# EAGLE design echo (EAGLE 7.4.0)

## Sheet 1 of 2
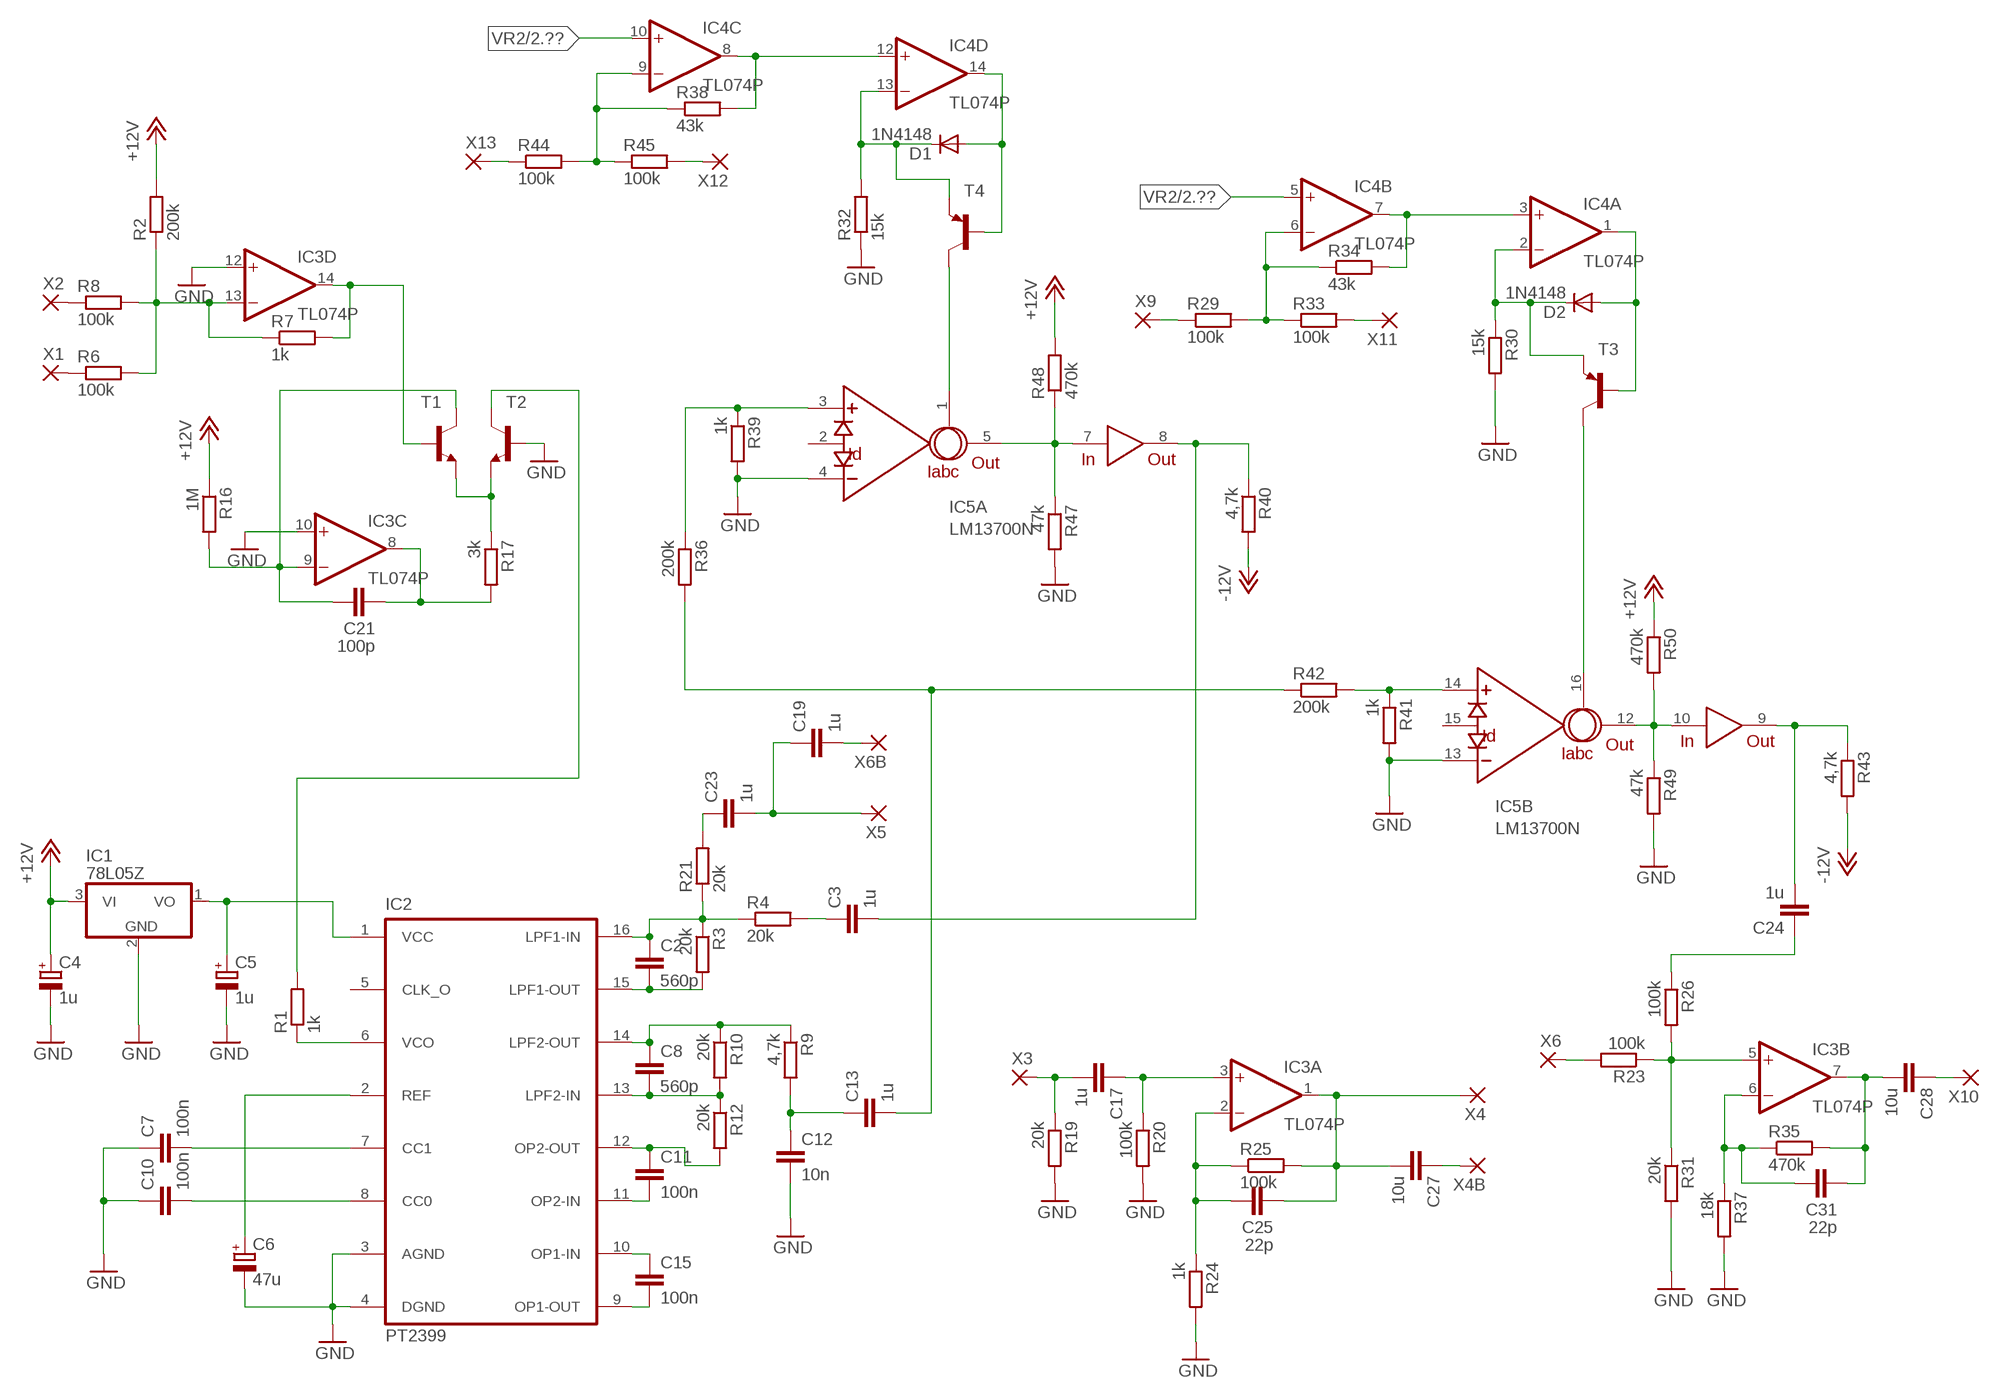
[diagram p0: schematic, sheet 1]

### Parts
C2  560p  C-EU050-035X075  [C050-035X075]
C3  1u  C-EU050-055X075  [C050-055X075]
C4  1u  CPOL-EUE2-5  [E2-5]
C5  1u  CPOL-EUE2-5  [E2-5]
C6  47u  CPOL-EUE2-5  [E2-5]
C7  100n  C-EU050-035X075  [C050-035X075]
C8  560p  C-EU050-035X075  [C050-035X075]
C10  100n  C-EU050-035X075  [C050-035X075]
C11  100n  C-EU050-035X075  [C050-035X075]
C12  10n  C-EU050-035X075  [C050-035X075]
C13  1u  C-EU050-055X075  [C050-055X075]
C15  100n  C-EU050-035X075  [C050-035X075]
C17  1u  C-EU050-055X075  [C050-055X075]
C19  1u  C-EU050-055X075  [C050-055X075]
C21  100p  C-EU025-025X050  [C025-025X050]
C23  1u  C-EU050-055X075  [C050-055X075]
C24  1u  C-EU050-055X075  [C050-055X075]
C25  22p  C-EU025-025X050  [C025-025X050]
C27  10u  C-EU050-055X075  [C050-055X075]
C28  10u  C-EU050-055X075  [C050-055X075]
C31  22p  C-EU025-025X050  [C025-025X050]
D1  1N4148  1N4148DO35-7  [DO35-7]
D2  1N4148  1N4148DO35-7  [DO35-7]
IC1  78L05Z  [TO92]
IC2  PT2399  [DIL16]
IC3  TL074P  [DIL14]
IC4  TL074P  [DIL14]
IC5  LM13700N  [DIL16]
R1  1k  R-EU_0309/V  [0309V]
R2  200k  R-EU_0309/V  [0309V]
R3  20k  R-EU_0309/V  [0309V]
R4  20k  R-EU_0309/V  [0309V]
R6  100k  R-EU_0309/V  [0309V]
R7  1k  R-EU_0309/V  [0309V]
R8  100k  R-EU_0309/V  [0309V]
R9  4,7k  R-EU_0309/V  [0309V]
R10  20k  R-EU_0309/V  [0309V]
R12  20k  R-EU_0309/V  [0309V]
R16  1M  R-EU_0309/V  [0309V]
R17  3k  R-EU_0309/V  [0309V]
R19  20k  R-EU_0309/V  [0309V]
R20  100k  R-EU_0309/V  [0309V]
R21  20k  R-EU_0309/V  [0309V]
R23  100k  R-EU_0309/V  [0309V]
R24  1k  R-EU_0309/V  [0309V]
R25  100k  R-EU_0309/V  [0309V]
R26  100k  R-EU_0309/V  [0309V]
R29  100k  R-EU_0309/V  [0309V]
R30  15k  R-EU_0309/V  [0309V]
R31  20k  R-EU_0309/V  [0309V]
R32  15k  R-EU_0309/V  [0309V]
R33  100k  R-EU_0309/V  [0309V]
R34  43k  R-EU_0309/V  [0309V]
R35  470k  R-EU_0309/V  [0309V]
R36  200k  R-EU_0309/V  [0309V]
R37  18k  R-EU_0309/V  [0309V]
R38  43k  R-EU_0309/V  [0309V]
R39  1k  R-EU_0309/V  [0309V]
R40  4,7k  R-EU_0309/V  [0309V]
R41  1k  R-EU_0309/V  [0309V]
R42  200k  R-EU_0309/V  [0309V]
R43  4,7k  R-EU_0309/V  [0309V]
R44  100k  R-EU_0309/V  [0309V]
R45  100k  R-EU_0309/V  [0309V]
R47  47k  R-EU_0309/V  [0309V]
R48  470k  R-EU_0309/V  [0309V]
R49  47k  R-EU_0309/V  [0309V]
R50  470k  R-EU_0309/V  [0309V]
T1  2N3904-NPN-TO92-EBC  [TO92-EBC]
T2  2N3904-NPN-TO92-EBC  [TO92-EBC]
T3  2N3906-PNP-TO92-EBC  [TO92-EBC]
T4  2N3906-PNP-TO92-EBC  [TO92-EBC]
X1  2,54/1,0  [2,54/1,0]
X2  2,54/1,0  [2,54/1,0]
X3  2,54/1,0  [2,54/1,0]
X4  2,54/1,0  [2,54/1,0]
X4B  2,54/1,0  [2,54/1,0]
X5  2,54/1,0  [2,54/1,0]
X6  2,54/1,0  [2,54/1,0]
X6B  2,54/1,0  [2,54/1,0]
X9  2,54/1,0  [2,54/1,0]
X10  2,54/1,0  [2,54/1,0]
X11  2,54/1,0  [2,54/1,0]
X12  2,54/1,0  [2,54/1,0]
X13  2,54/1,0  [2,54/1,0]

### Nets
+12V: C4.+ IC1.3(VI) R2.2 R16.1 R48.2 R50.1 ; also sheet 2
-12V: R40.2 R43.2 ; also sheet 2
GND: C4.- C5.- C6.- C7.1 C10.1 C12.2 IC1.2(GND) IC2.3(AGND) IC2.4(DGND) IC3.10(C:+IN) IC3.12(D:+IN) IC5.4(A:-IN) IC5.13(B:-IN) R19.2 R20.2 R24.2 R30.2 R31.2 R32.1 R37.2 R39.2 R41.2 R47.2 R49.2 T2.B ; also sheet 2
N$1: C7.2 IC2.7(CC1)
N$2: C10.2 IC2.8(CC0)
N$3: C5.+ IC1.1(VO) IC2.1(VCC)
N$4: C15.1 IC2.10(OP1-IN)
N$5: C6.+ IC2.2(REF)
N$6: C15.2 IC2.9(OP1-OUT)
N$7: C11.2 IC2.11(OP2-IN)
N$8: C11.1 IC2.12(OP2-OUT) R12.2
N$9: C19.2 X6B.1(P)
N$10: C2.2 IC2.15(LPF1-OUT) R3.2
N$11: C8.1 IC2.14(LPF2-OUT) R9.1 R10.1
N$12: C8.2 IC2.13(LPF2-IN) R10.2 R12.1
N$13: IC2.6(VCO) R1.1
N$14: C3.1 R4.2
N$15: C12.1 C13.1 R9.2
N$16: C23.1 R21.2
N$17: C2.1 IC2.16(LPF1-IN) R3.1 R4.1 R21.1
N$18: C19.1 C23.2 X5.1(P)
N$19: IC3.5(B:+IN) R23.1 R26.2 R31.1
N$20: R23.2 X6.1(P)
N$21: R44.1 X13.1(P)
N$22: IC4.9(C:-IN) R38.1 R44.2 R45.1
N$23: R45.2 X12.1(P)
N$24: IC4.8(C:OUT) IC4.12(D:+IN) R38.2
N$25: D1.A IC4.14(D:OUT) T4.B
N$26: D1.C IC4.13(D:-IN) R32.2 T4.E
N$27: IC5.5(A:OUT) IC5.7(IN) R47.1 R48.1
N$28: C24.2 IC5.9(OUT) R43.1
N$29: IC5.3(A:+IN) R36.1 R39.1
N$30: C13.2 R36.2 R42.1
N$31: C3.2 IC5.8(OUT) R40.1
N$32: IC5.1(A:IABC) T4.C
N$33: IC5.10(IN) IC5.12(B:OUT) R49.1 R50.2
N$34: IC5.14(B:+IN) R41.1 R42.2
N$35: IC4.3(A:+IN) IC4.7(B:OUT) R34.2
N$36: R29.1 X9.1(P)
N$37: R33.2 X11.1(P)
N$38: C25.1 IC3.2(A:-IN) R24.1 R25.1
N$39: IC4.6(B:-IN) R29.2 R33.1 R34.1
N$40: D2.A IC4.1(A:OUT) T3.B
N$41: D2.C IC4.2(A:-IN) R30.1 T3.E
N$42: IC5.16(B:IABC) T3.C
N$43: C24.1 R26.1
N$44: C31.1 IC3.6(B:-IN) R35.1 R37.1
N$45: C28.2 C31.2 IC3.7(B:OUT) R35.2
N$46: C28.1 X10.1(P)
N$47: C25.2 C27.2 IC3.1(A:OUT) R25.2 X4.1(P)
N$48: C27.1 X4B.1(P)
N$49: C17.2 R19.1 X3.1(P)
N$50: C17.1 IC3.3(A:+IN) R20.1
N$51: C21.1 IC3.9(C:-IN) R16.2 T1.C
N$52: C21.2 IC3.8(C:OUT) R17.2
N$53: R17.1 T1.E T2.E
N$54: IC3.14(D:OUT) R7.2 T1.B
N$55: R1.2 T2.C
N$56: IC3.13(D:-IN) R2.1 R6.2 R7.1 R8.2
N$57: R6.1 X1.1(P)
N$58: R8.1 X2.1(P)
VR2: IC4.5(B:+IN) IC4.10(C:+IN) ; also sheet 2
Unconnected: IC2.5(CLK_O) IC5.2(A:ID) IC5.15(B:ID)

## Sheet 2 of 2
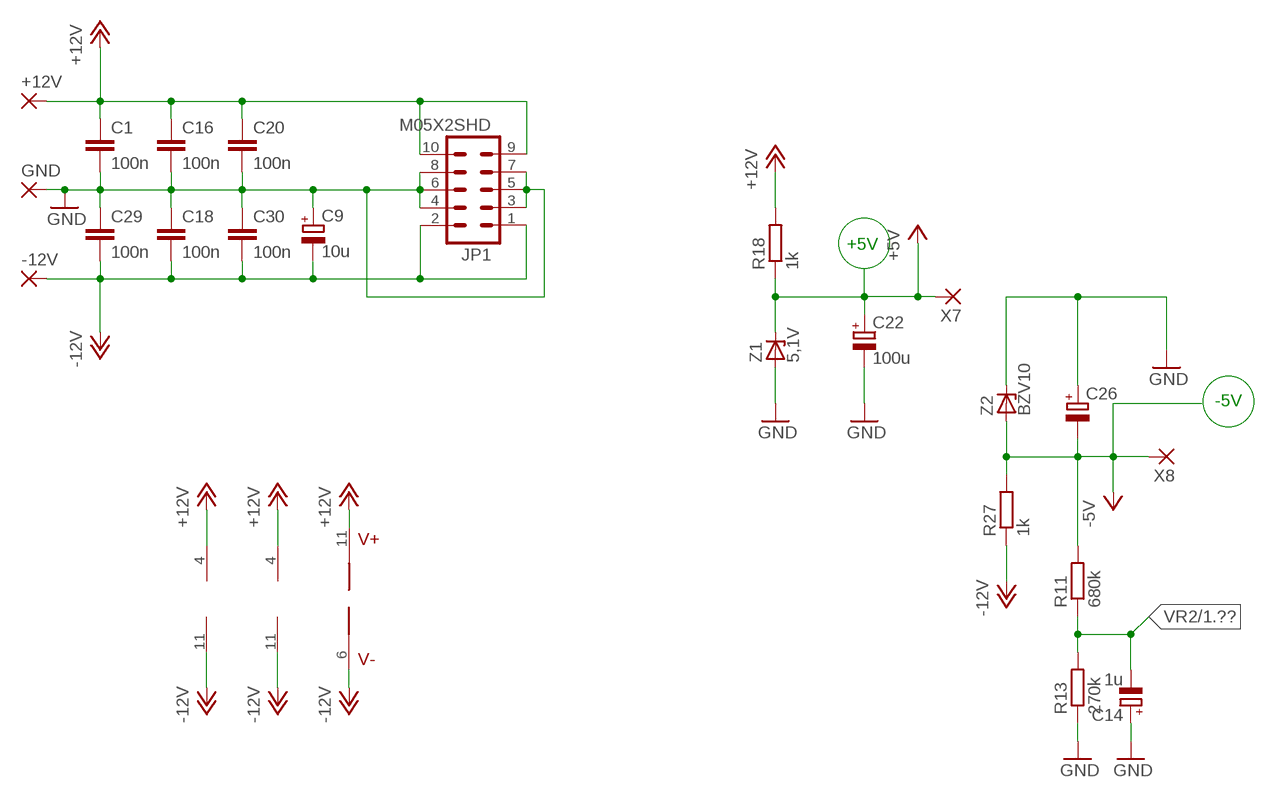
[diagram p1: schematic, sheet 2]

### Parts
+12V  2,54/1,0  [2,54/1,0]
-12V  2,54/1,0  [2,54/1,0]
C1  100n  C-EU025-025X050  [C025-025X050]
C9  10u  CPOL-EUE2-5  [E2-5]
C14  1u  CPOL-EUE2-5  [E2-5]
C16  100n  C-EU025-025X050  [C025-025X050]
C18  100n  C-EU025-025X050  [C025-025X050]
C20  100n  C-EU025-025X050  [C025-025X050]
C22  100u  CPOL-EUE2-5  [E2-5]
C26  CPOL-EUE2-5  [E2-5]
C29  100n  C-EU025-025X050  [C025-025X050]
C30  100n  C-EU025-025X050  [C025-025X050]
GND  2,54/1,0  [2,54/1,0]
JP1  M05X2SHD  [2X5-SHROUDED]
R11  680k  R-EU_0309/V  [0309V]
R13  270k  R-EU_0309/V  [0309V]
R18  1k  R-EU_0309/V  [0309V]
R27  1k  R-EU_0309/V  [0309V]
X7  2,54/1,0  [2,54/1,0]
X8  2,54/1,0  [2,54/1,0]
Z1  5,1V  BZV10  [DO34Z7]
Z2  BZV10  [DO34Z7]

### Nets
+5V: C22.+ R18.1 X7.1(P) Z1.C
+12V: +12V.1(P) C1.1 C16.1 C20.1 IC3.4(P:V+) IC4.4(P:V+) IC5.11(V+) JP1.9 JP1.10 R18.2 ; also sheet 1
-5V: C26.- R11.2 R27.2 X8.1(P) Z2.A
-12V: -12V.1(P) C9.- C18.2 C29.2 C30.2 IC3.11(P:V-) IC4.11(P:V-) IC5.6(V-) JP1.1 JP1.2 R27.1 ; also sheet 1
GND: C1.2 C9.+ C14.+ C16.2 C18.1 C20.2 C22.- C26.+ C29.1 C30.1 GND.1(P) JP1.3 JP1.4 JP1.5 JP1.6 JP1.7 JP1.8 R13.1 Z1.A Z2.C ; also sheet 1
VR2: C14.- R11.1 R13.2 ; also sheet 1

### Notes on the sheet
- +5V
- -5V

## Library data of the parts
+12V -12V GND X1-X4 X4B X5 X6 X6B X7-X13 = wirepad:2,54/1,0: THROUGH-HOLE PAD
C1-C3 C7 C8 C10-C13 C15-C21 C23-C25 C27-C31 = rcl:C-EU: CAPACITOR, European symbol
C4-C6 C9 C14 C22 C26 = rcl:CPOL-EU: POLARIZED CAPACITOR, European symbol
D1 D2 = diode:1N4148: DIODE high speed (Philips)
IC1 = cavalier:78*: Positive VOLTAGE REGULATOR Source: http://cache.national.com/ds/LM/LM78L05.pdf http://www.fairchildsemi.com/ds/LM/LM7805.pdf
IC2 = princeton-tech:PT2399: Echo Processor IC
IC3 IC4 = cavalier:TL074: OP AMP
IC5 = synthdiy:LM13700: National Dual OTA with buffers.
JP1 = SparkFun:M05X2: Header 5x2 Standard 10-pin dual row 0.1" header. Commonly used with AVR-ISP. Use with Spark Fun Electronics SKU: PRT-00778
R1-R4 R6-R13 R16-R21 R23-R27 R29-R45 R47-R50 = rcl:R-EU_: RESISTOR, European symbol
T1 T2 = transistor-neu-to92:*-NPN-: NPN Transistror
T3 T4 = transistor-neu-to92:*-PNP-: PNP Transistror
Z1 Z2 = diode:BZV10: Z DIODE

## Board
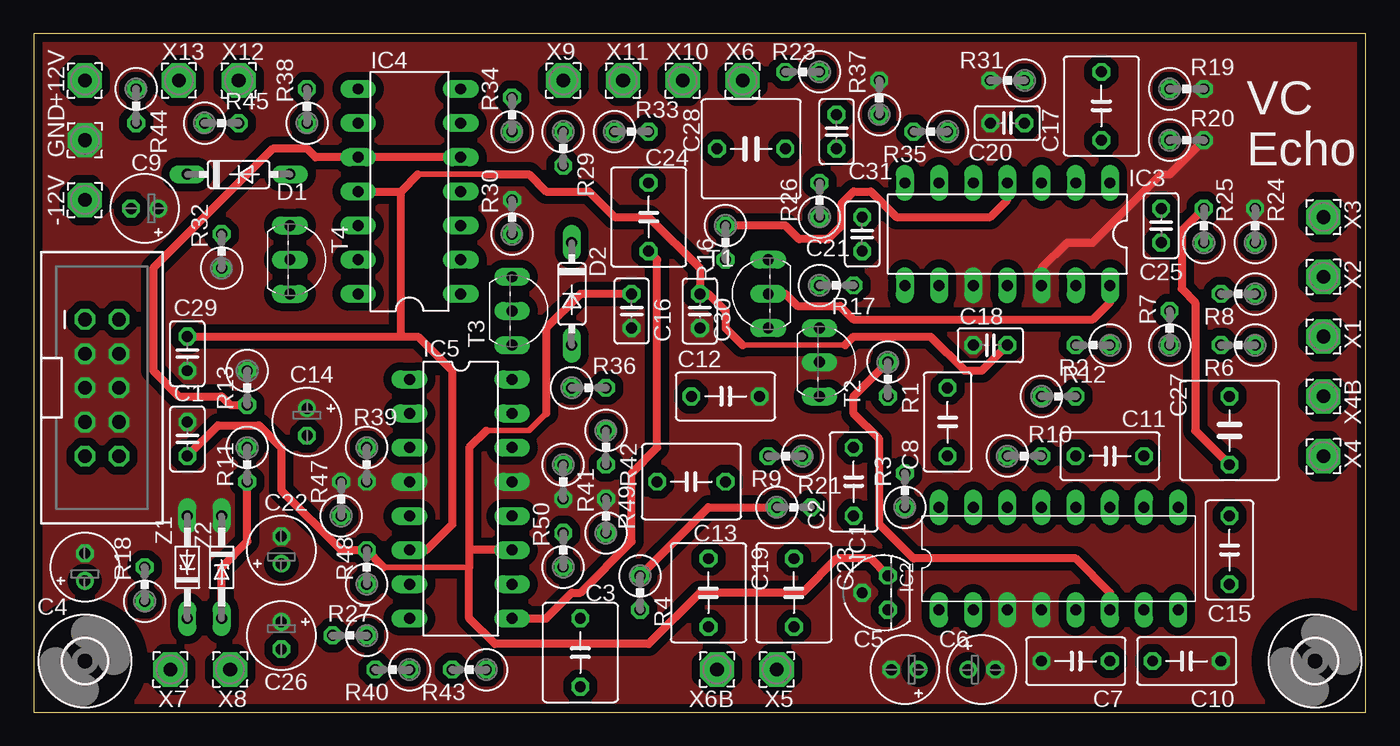
[diagram p2: board, top side]
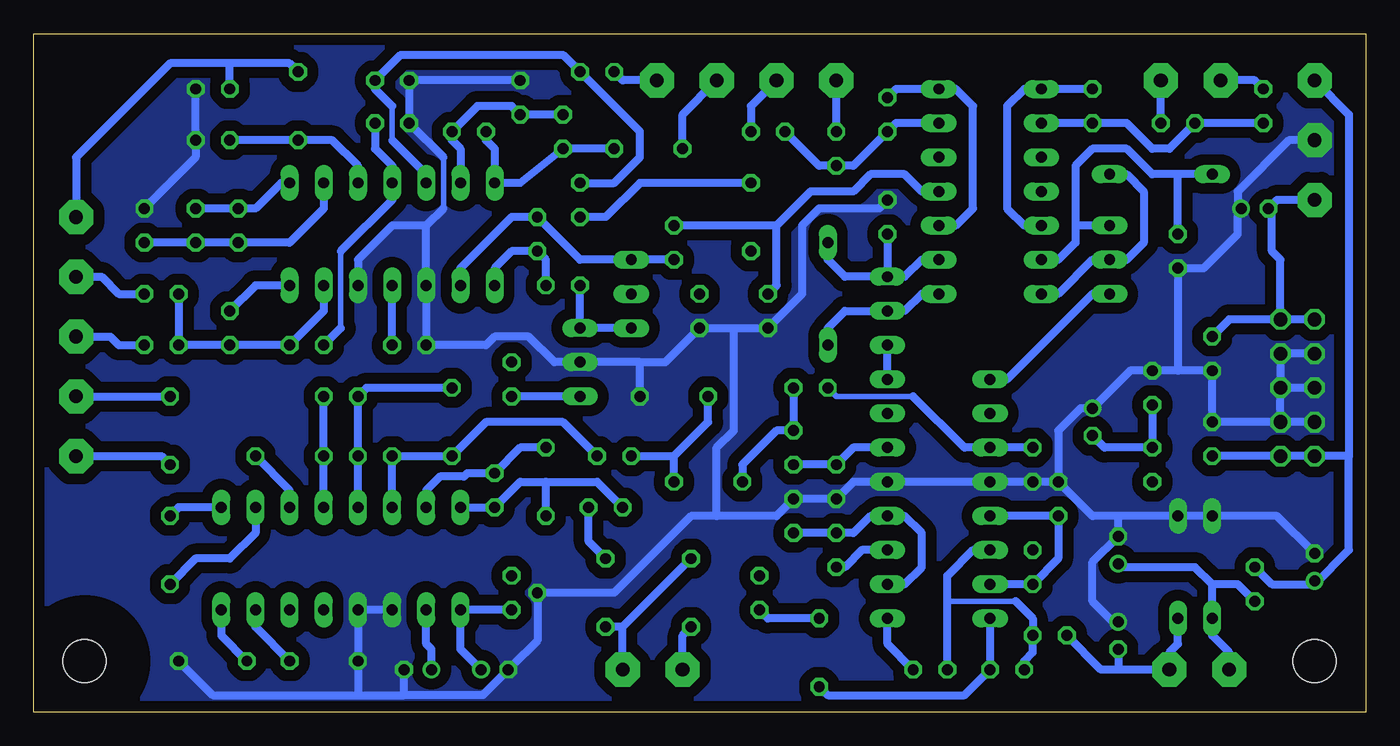
[diagram p3: board, bottom side, seen from below]

Size 99.04 x 50.47 mm. Coordinates in mm from the lower left corner, seen from the top.
Outline: 0,0 99.04,0 99.04,50.47 0,50.47 0,0
Copper layers (1*16): Top 0.035mm / dielectric 1.5mm / Bottom 0.035mm
Design rules "default *": minimum track width 10mil, minimum drill 24mil, track to track 8mil, track to pad 8mil, pad to pad 8mil, via to via 8mil, smd to smd 8mil, copper to edge 25mil, drill to drill 8mil, minimum pad ring 10mil, minimum via ring 8mil, stop-mask expansion 4mil, vias tented up to drill 0mil, thermal gap 10mil

### Footprints (pad centres in the part's own frame; a part is rotated, then mirrored left to right if it is on the bottom)
2,54/1,0 = drill 1.016 pad 2.54 octagon: 1 0,0
C025-025X050 = drill 0.813 octagon: 1 -1.27,0; 2 1.27,0
C050-035X075 = drill 0.813 octagon: 1 -2.54,0; 2 2.54,0
C050-055X075 = drill 0.813 octagon: 1 -2.54,0; 2 2.54,0
E2-5 = drill 0.813 pad 1.27: + -1.016,0 | drill 0.813 pad 1.27 octagon: - 1.016,0
C050-075X075 = drill 0.813 octagon: 1 -2.54,0; 2 2.54,0
DO35-7 = drill 0.813 long: A 3.81,0; C -3.81,0
TO92 = drill 0.813 octagon: 1 -1.27,0; 2 0,1.905; 3 1.27,0
DIL16 = drill 0.813 long: 1 -8.89,-3.81; 2 -6.35,-3.81; 3 -3.81,-3.81; 4 -1.27,-3.81; 5 1.27,-3.81; 6 3.81,-3.81; 7 6.35,-3.81; 8 8.89,-3.81; 9 8.89,3.81; 10 6.35,3.81; 11 3.81,3.81; 12 1.27,3.81; 13 -1.27,3.81; 14 -3.81,3.81; 15 -6.35,3.81; 16 -8.89,3.81
DIL14 = drill 0.813 long: 1 -7.62,-3.81; 2 -5.08,-3.81; 3 -2.54,-3.81; 4 0,-3.81; 5 2.54,-3.81; 6 5.08,-3.81; 7 7.62,-3.81; 8 7.62,3.81; 9 5.08,3.81; 10 2.54,3.81; 11 0,3.81; 12 -2.54,3.81; 13 -5.08,3.81; 14 -7.62,3.81
2X5-SHROUDED = drill 1.016 octagon: 1 -1.27,5.08; 2 1.27,5.08; 3 -1.27,2.54; 4 1.27,2.54; 5 -1.27,0; 6 1.27,0; 7 -1.27,-2.54; 8 1.27,-2.54; 9 -1.27,-5.08; 10 1.27,-5.08
0309V = drill 0.813 octagon: 1 -1.27,0; 2 1.27,0
TO92-EBC = drill 0.813 long: B 0,-1.27; C 2.54,-1.27; E -2.54,-1.27
3,2 = hole 3.2: 0,0
DO34Z7 = drill 0.813 long: A 3.81,0; C -3.81,0

### Placement (x,y rotation side)
+12V  3.81,46.99 0 top
-12V  3.81,38.1 0 top
C1  11.43,20.32 90 top
C2  60.96,17.14 90 top
C3  40.64,4.45 270 top
C4  3.81,10.79 90 top
C5  64.77,3.17 180 top
C6  70.48,3.17 0 top
C7  77.47,3.81 0 top
C8  67.94,21.59 90 top
C9  8.26,37.47 180 top
C10  85.72,3.81 180 top
C11  80.01,19.05 0 top
C12  51.44,23.5 0 top
C13  48.9,17.14 180 top
C14  20.32,21.59 270 top
C15  88.9,12.06 90 top
C16  44.45,29.84 270 top
C17  79.38,45.09 90 top
C18  71.12,27.3 0 top
C19  50.16,8.89 270 top
C20  72.39,43.81 180 top
C21  61.59,35.56 270 top
C22  18.41,12.06 90 top
C23  56.52,8.89 270 top
C24  45.72,36.83 270 top
C25  83.82,36.2 90 top
C26  18.41,5.71 270 top
C27  10u  [C050-075X075]  88.9,20.95 270 top
C28  10u  [C050-075X075]  53.34,41.91 0 top
C29  11.43,26.67 90 top
C30  49.53,29.84 90 top
C31  59.69,43.18 270 top
D1  15.24,40.01 0 top
D2  40.01,31.11 270 top
GND  3.81,42.55 0 top
IC1  63.5,8.89 90 top
IC2  76.2,11.43 0 top
IC3  72.39,35.56 180 top
IC4  27.94,38.73 90 top
IC5  31.75,15.88 270 top
JP1  5.08,24.13 0 top
R1  63.5,24.77 270 top
R2  78.74,27.3 180 top
R3  64.77,16.51 90 top
R4  45.09,8.89 270 top
R6  89.53,27.3 180 top
R7  84.45,28.57 90 top
R8  89.53,31.11 180 top
R9  55.88,19.05 180 top
R10  73.66,19.05 0 top
R11  15.88,18.41 270 top
R12  76.2,23.5 0 top
R13  15.88,24.13 270 top
R16  51.44,34.92 270 top
R17  59.69,31.75 0 top
R18  8.26,9.53 90 top
R19  85.72,46.35 0 top
R20  85.72,42.55 0 top
R21  56.52,15.24 0 top
R23  57.15,47.62 180 top
R24  90.81,36.2 90 top
R25  87,36.2 90 top
R26  58.42,38.1 90 top
R27  23.5,5.71 180 top
R29  39.37,41.91 270 top
R30  35.56,36.83 90 top
R31  72.39,46.99 180 top
R32  13.97,34.29 90 top
R33  44.45,43.18 0 top
R34  35.56,44.45 90 top
R35  66.67,43.18 180 top
R36  41.27,24.13 0 top
R37  62.87,45.72 90 top
R38  20.32,45.09 90 top
R39  24.77,18.41 270 top
R40  26.67,3.17 180 top
R41  39.37,17.14 270 top
R42  42.55,19.68 270 top
R43  32.38,3.17 180 top
R44  7.62,45.09 270 top
R45  13.97,43.81 0 top
R47  22.86,15.88 90 top
R48  24.77,10.79 90 top
R49  42.55,14.61 90 top
R50  39.37,12.06 90 top
T1  53.34,31.11 90 top
T2  59.69,26.04 270 top
T3  36.83,29.84 270 top
T4  20.32,33.66 270 top
U$1  [3,2]  3.81,3.81 0 top
U$2  [3,2]  95.25,3.81 0 top
X1  95.89,27.94 270 top
X2  95.89,32.38 270 top
X3  95.89,36.83 270 top
X4  95.89,19.05 270 top
X4B  95.89,23.5 270 top
X5  55.24,3.17 180 top
X6  52.7,46.99 0 top
X6B  50.8,3.17 180 top
X7  10.16,3.17 180 top
X8  14.61,3.17 180 top
X9  39.37,46.99 0 top
X10  48.26,46.99 0 top
X11  43.81,46.99 0 top
X12  15.24,46.99 270 top
X13  10.79,46.99 270 top
Z1  11.43,10.79 90 top
Z2  13.97,10.79 270 top

### Tracks (layer width: path | path; a pad name or v marks a point on that pad's centre or on a via)
+5V
  Bottom 0.61: X7.1 10.16,4.45 11.43,5.71 Z1.C 11.43,9.53 | 11.43,9.53 12.7,10.79 18.16,10.79 C22.+ | R18.1 9.53,9.53 11.43,9.53
+12V
  Top 0.406: 26.04,10.79 32.38,10.79 | 33.66,20.95 36.83,20.95 38.1,22.23
  Top 0.61: IC5.11 32.38,12.06 | 32.38,12.06 32.38,10.79 32.38,6.99 34.29,5.08 45.72,5.08 49.53,8.89 57.15,8.89 59.69,11.43 62.23,11.43 IC1.3 | 26.04,10.79 R48.2 22.86,12.06 18.41,16.51 18.41,19.68 16.76,21.34 13.72,21.34 C1.1 | C16.1 40.64,31.11 38.1,28.57 38.1,22.23 | 33.66,20.95 32.38,19.68 32.38,12.06 | IC3.4 72.39,38.1 71.12,36.83 64.14,36.83 62.23,38.73 60.96,38.73 60.07,37.85 60.07,36.2 59.05,35.18 56.9,35.18 55.88,36.2 R16.1
  Bottom 0.406: 76.2,34.29 76.2,28.57
  Bottom 0.61: R18.2 6.99,9.53 3.81,9.53 | 3.81,9.53 1.27,12.06 1.27,19.05 | 1.27,19.05 JP1.9 JP1.10 C1.1 | C4.+ 3.81,9.53 | C20.1 73.66,41.91 72.39,40.64 IC3.4 72.39,38.1 76.2,34.29 | 76.2,28.57 R2.2 | IC5.11 37.47,12.06 38.73,10.79 R50.1 | +12V.1 1.27,44.45 1.27,19.05 | 43.81,36.2 41.27,38.73 38.1,38.73 36.83,40.01 34.29,40.01 33.02,38.73 IC4.4 | C16.1 43.81,31.75 43.81,36.2 | 43.81,36.2 R16.1
-5V
  Top 0.61: Z2.A 13.97,10.79 15.88,12.7 R11.2
  Bottom 0.61: Z2.A 13.97,5.08 14.61,4.45 X8.1 18.41,3.17 | 18.41,3.17 19.68,3.17 R27.2 | C26.- 18.41,3.17
-12V
  Top 0.406: 28.57,40.01 33.66,40.01 | 52.7,27.3 60.33,27.3
  Top 0.61: C18.2 70.48,25.4 69.22,25.4 66.67,27.94 60.96,27.94 60.33,27.3 | 52.7,27.3 51.44,28.57 51.44,29.84 50.16,31.11 C30.2 49.53,33.02 45.72,36.83 43.18,36.83 41.27,38.73 38.1,38.73 36.83,40.01 33.66,40.01 | 27.3,27.94 27.3,38.73 | IC4.11 27.3,38.73 | C29.2 27.3,27.94 | 27.3,27.94 28.57,27.94 31.11,25.4 31.11,13.97 29.21,12.06 IC5.6 | 28.57,40.01 27.3,38.73
  Bottom 0.406: 26.04,8.26 31.11,8.26
  Bottom 0.61: C18.2 IC3.11 | JP1.1 JP1.2 | JP1.2 10.16,29.21 C29.2 | JP1.2 6.35,33.66 6.99,34.29 6.99,37.21 C9.- 6.6,38.1 -12V.1 | IC5.6 29.21,12.06 31.11,10.16 31.11,8.26 R43.2 | R40.2 25.4,3.81 24.77,4.45 R27.1 24.77,6.99 26.04,8.26
GND
  Top 0.61: IC3.12 74.93,33.02 76.83,34.92 78.74,34.92 83.82,40.01 84.45,40.01 R20.2
  Bottom 0.406: 68.58,41.27 68.58,37.47
  Bottom 0.61: C10.1 85.72,1.27 74.93,1.27 | 74.93,1.27 71.5,1.27 | 63.5,3.56 63.88,3.05 65.66,1.27 71.5,1.27 | 63.5,3.56 C5.- 63.5,3.43 | 63.5,3.43 61.59,5.33 IC1.2 55.88,8.89 50.16,14.61 48.26,14.61 | 63.5,3.56 63.5,3.43 | 71.5,1.27 C6.- | 74.93,1.27 C7.1 IC2.4 IC2.3 | R37.2 R31.2 C20.2 68.58,41.27 | R19.2 R20.2 87,41.27 R24.2 | 53.98,26.04 T2.B 60.33,26.04 62.23,27.94 64.77,27.94 65.41,27.3 C18.1 IC3.10 69.85,36.2 | C12.2 53.98,26.04 | 53.98,26.04 52.07,26.04 C30.1 46.99,28.57 | 46.99,28.57 C16.2 41.91,31.11 41.91,36.2 40.64,37.47 36.2,37.47 R30.2 | 68.58,37.47 69.85,36.2 | 69.85,36.2 72.39,36.2 74.93,33.66 IC3.12 | C4.- 6.6,14.61 Z1.A Z2.C 18.41,14.61 | 18.41,14.61 20.32,14.61 R47.2 | R47.2 R39.2 IC5.4 IC5.13 38.1,17.14 R41.2 R49.2 43.81,14.61 48.26,14.61 | 18.41,14.61 C22.- 20.32,11.18 20.32,8.26 18.8,6.73 C26.+ | GND.1 5.71,42.55 9.53,38.73 9.53,37.72 C9.+ 9.53,37.21 9.53,35.56 12.06,33.02 R32.1 13.97,25.4 | JP1.3 JP1.4 JP1.6 | JP1.5 JP1.6 | JP1.7 JP1.8 | JP1.8 JP1.6 | JP1.8 C1.2 C29.1 13.97,25.4 | 13.97,25.4 R13.1 17.53,25.4 C14.+ 21.21,22.61 22.86,20.95 R47.2 | 48.26,14.61 48.26,19.68 46.99,20.95 46.99,28.57
  pour Bottom (isolate 0.813, no thermals): 0,50.16 0,0 99.06,0 99.06,50.16
  pour Top (isolate 0.61, no thermals): 0.64,50.16 0.64,0 98.42,0 98.42,50.16
N$1
  Bottom 0.61: IC2.7 82.55,6.35 C7.2
N$2
  Bottom 0.61: IC2.8 85.09,5.71 C10.2
N$3
  Bottom 0.61: IC1.1 IC2.1 67.31,4.7 C5.+
N$4
  Bottom 0.61: IC2.10 82.55,13.34 84.45,11.43 87,11.43 C15.1
N$5
  Bottom 0.61: C6.+ 69.47,4.7 69.85,5.08 IC2.2
N$6
  Bottom 0.61: IC2.9 88.27,15.24 C15.2
N$7
  Bottom 0.61: IC2.11 80.01,16.51 C11.2
N$8
  Bottom 0.61: IC2.12 C11.1 R12.2
N$9
  Bottom 0.61: X6B.1 50.8,5.71 C19.2
N$10
  Bottom 0.61: C2.2 62.87,19.68 R3.2 66.8,17.78 67.06,17.53 68.83,17.53 69.85,16.51 IC2.15
N$11
  Bottom 0.61: IC2.14 R10.1 C8.1 65.41,21.59 59.69,21.59 R9.1
N$12
  Bottom 0.61: IC2.13 R10.2 R12.1 74.3,24.13 C8.2
N$13
  Top 0.61: IC2.6 80.01,8.89 77.47,11.43 65.41,11.43 62.87,13.97 62.87,20.32 60.96,22.23 60.96,23.5 R1.1
N$14
  Bottom 0.61: C3.1 44.45,6.99 R4.2
N$15
  Bottom 0.61: R9.2 51.44,19.05 | 51.44,19.05 48.9,21.59 C12.1 | C13.1 51.44,19.05
N$16
  Bottom 0.61: C23.1 57.78,12.7 R21.2
N$17
  Top 0.61: R4.1 50.16,15.24 R21.1
  Bottom 0.61: IC2.16 R3.1 62.87,17.14 60.96,17.14 | 60.96,17.14 57.15,17.14 R21.1 | C2.1 60.96,17.14
N$18
  Bottom 0.61: C19.1 55.24,6.35 | 55.24,6.35 C23.2 | X5.1 55.24,6.35
N$19
  Bottom 0.406: 72.39,45.09 72.39,42.55
  Bottom 0.61: R26.2 55.88,39.37 53.98,41.27 53.98,43.18 R23.1 59.69,48.9 71.75,48.9 R31.1 73.66,46.35 72.39,45.09 | IC3.5 69.85,40.01 72.39,42.55
N$20
  Bottom 0.61: X6.1 55.24,46.99 R23.2
N$21
  Bottom 0.61: R44.1 8.26,46.99 X13.1
N$22
  Bottom 0.61: R44.2 R45.1 14.61,41.91 15.88,41.91 17.78,43.81 R38.1 IC4.9
N$23
  Bottom 0.61: R45.2 X12.1
N$24
  Bottom 0.61: R38.2 IC4.8 25.4,46.35 26.67,45.09 26.67,37.47 25.4,36.2 IC4.12
N$25
  Bottom 0.61: D1.A 17.78,40.01 16.51,38.73 16.51,34.92 17.78,33.66 T4.B 20.32,33.66 22.86,31.11 IC4.14
N$26
  Bottom 0.61: D1.C 13.97,40.01 | 13.97,40.01 15.88,40.01 17.78,41.91 20.32,41.91 21.59,40.64 21.59,36.2 | 21.59,36.2 21.59,34.92 22.86,33.66 IC4.13 | T4.E 21.59,36.2 | R32.2 13.97,40.01
N$27
  Bottom 0.61: IC5.7 R48.1 22.86,11.43 R47.1 IC5.5
N$28
  Top 0.61: IC5.9 38.1,6.99 40.01,8.89 40.64,8.89 44.45,12.7 44.45,17.78 46.35,19.68 46.35,33.66 C24.2
  Bottom 0.61: R43.1 35.56,5.08 IC5.9
N$29
  Bottom 0.406: 33.66,23.5 39.37,23.5 R36.1
  Bottom 0.61: R39.1 IC5.3 | 28.57,19.68 IC5.3 | IC5.3 29.84,19.68 33.66,23.5
N$30
  Bottom 0.61: R36.2 R42.1 43.81,20.95 46.35,18.41 C13.2
N$31
  Bottom 0.61: C3.2 40.01,1.27 29.84,1.27 R40.1 IC5.8
N$32
  Bottom 0.61: T4.C 20.32,31.11 26.67,24.77 IC5.1
N$33
  Bottom 0.61: IC5.10 34.29,9.53 33.02,10.79 33.02,13.34 34.29,14.61 IC5.12 36.83,14.61 38.1,13.34 R50.2 R49.1
N$34
  Bottom 0.61: IC5.14 38.1,19.68 R41.1 R42.2
N$35
  Bottom 0.61: IC4.3 30.48,36.2 29.21,37.47 29.21,45.09 30.48,46.35 IC4.7 34.92,46.35 R34.2
N$36
  Bottom 0.61: R29.1 X9.1
N$37
  Bottom 0.61: X11.1 45.72,45.09 R33.2
N$38
  Bottom 0.61: IC3.2 77.47,37.47 80.01,34.92 C25.1 R25.1 R24.1
N$39
  Bottom 0.61: IC4.6 34.92,43.81 R34.1 38.1,40.64 R29.2 40.64,40.64 R33.1
N$40
  Bottom 0.61: D2.A 40.01,28.57 38.73,29.84 T3.B 34.29,29.84 33.02,31.11 IC4.1
N$41
  Bottom 0.61: IC4.2 33.02,33.66 34.29,32.38 T3.E | T3.E 38.73,32.38 40.01,33.66 D2.C | R30.1 T3.E
N$42
  Bottom 0.61: IC5.16 T3.C
N$43
  Bottom 0.61: C24.1 53.98,39.37 56.52,36.83 R26.1
N$44
  Bottom 0.61: IC3.6 67.31,41.91 67.94,42.55 R35.1 66.04,45.09 63.5,45.09 R37.1 C31.1
N$45
  Bottom 0.61: C28.2 C31.2 62.87,39.37 IC3.7 64.77,41.91 65.41,42.55 R35.2
N$46
  Bottom 0.61: C28.1 50.8,44.45 X10.1
N$47
  Top 0.61: R25.2 85.34,35.81 85.34,31.5 86.36,30.48 86.36,20.95 C27.2
  Bottom 0.61: IC3.1 80.64,39.37 82.55,37.47 C25.2 R25.2 | X4.1 89.53,19.05 C27.2
N$48
  Bottom 0.61: X4B.1 C27.1
N$49
  Bottom 0.61: C17.2 80.01,48.26 84.45,48.26 | 84.45,48.26 88.9,48.26 95.89,41.27 X3.1 | R19.1 84.45,48.26
N$50
  Bottom 0.61: IC3.3 74.93,40.64 76.83,42.55 C17.1 R20.1
N$51
  Bottom 0.61: IC3.9 67.31,33.02 63.5,36.83 C21.1 58.42,33.66 T1.C R16.2
N$52
  Bottom 0.61: IC3.8 64.77,33.02 63.5,34.29 C21.2 60.96,33.66 R17.2
N$53
  Bottom 0.61: T1.E T2.E R17.1
N$54
  Top 0.61: T1.B 55.88,31.11 56.77,30.23 59.94,30.23 60.96,29.21 78.74,29.21 80.01,30.48 IC3.14
  Bottom 0.61: IC3.14 82.55,31.75 R7.2
N$55
  Bottom 0.61: T2.C R1.2
N$56
  Bottom 0.61: R8.2 R6.2 R7.1 R2.1 77.47,29.84 IC3.13
N$57
  Bottom 0.61: X1.1 93.34,27.94 92.71,27.3 R6.1
N$58
  Bottom 0.61: X2.1 93.98,32.38 92.71,31.11 R8.1
VR2
  Top 0.61: IC4.5 IC4.10 20.95,41.27 20.32,41.91 17.78,41.91 8.89,33.02 8.89,25.4 10.79,23.5 13.97,23.5 14.61,22.86 R13.2
  Bottom 0.61: R13.2 R11.1 19.43,19.68 C14.-

### Text on the board
tPlace: VC / Echo